# Altium schematic sheet NUCLEO-F410RB-Motor.SchDoc
size A4
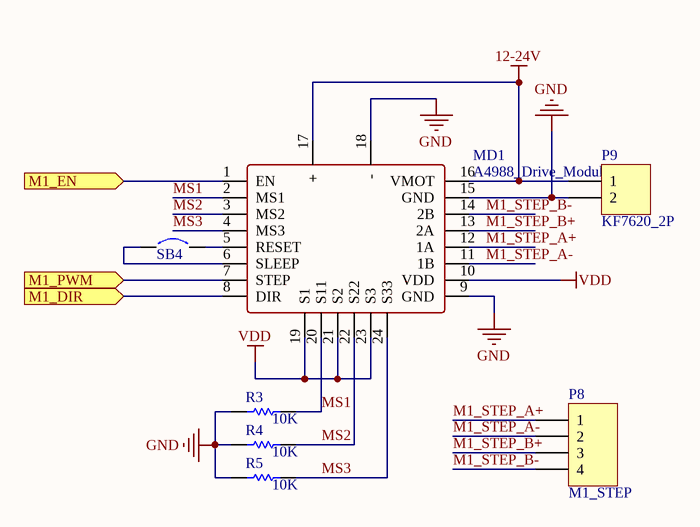
[diagram p0: NUCLEO-F410RB-Motor.SchDoc]

## Parts
MD1  A4988_Drive_Module  [A4988_Module]
P8  M1_STEP  [HDR1X4-Male]
P9  KF7620_2P  [KF-7.62-2P]
R3  value 10K  [R0603]  (hidden comment: Res_US)
R4  value 10K  [R0603]  (hidden comment: Res_US)
R5  value 10K  [R0603]  (hidden comment: Res_US)
SB4  Circuit Breaker  [JP2_SMD]  (value not drawn)

## Ports
M1_DIR (in), M1_EN (in), M1_PWM (in)

## Nets
12-24V: MD1.16(VMOT) MD1.17(+) P9.1
GND: MD1.9(GND) MD1.15(GND) MD1.18(-) P9.2 R3.1 R4.1 R5.1
VDD: MD1.10(VDD) MD1.19(S1) MD1.21(S2) MD1.23(S3)
M1_DIR: MD1.8(DIR) ; port M1_DIR
M1_EN: MD1.1(EN) ; port M1_EN
M1_PWM: MD1.7(STEP) ; port M1_PWM
M1_STEP_A+: MD1.12(1A) P8.1
M1_STEP_A-: MD1.11(1B) P8.2
M1_STEP_B+: MD1.13(2A) P8.3
M1_STEP_B-: MD1.14(2B) P8.4
MS1: MD1.2(MS1) MD1.20(S11) R3.2
MS2: MD1.3(MS2) MD1.22(S22) R4.2
MS3: MD1.4(MS3) MD1.24(S33) R5.2
NetMD1_5: MD1.5(RESET) SB4.2
NetMD1_6: MD1.6(SLEEP) SB4.1

## Library data of the parts
P8 = Header 4: Header, 4-Pin; LatestRevisionDate: 17-Jul-2002; LatestRevisionNote: Re-released for DXP Platform.; Publisher: Altium Limited
P9 = KF7620_2P: KF7620 接线端子; LatestRevisionDate: 17-Jul-2002; LatestRevisionNote: Re-released for DXP Platform.; Publisher: Altium Limited
R3-R5 = Res_US: Resistor; Published: 8-Jun-2000; LatestRevisionDate: 29-May-2009; LatestRevisionNote: IPC-7351 Footprint Added.; PackageReference: J1-0603; Publisher: Altium Limited; PackageDescription: Chip Resistor
SB4 = Circuit Breaker: Solder: NO; Published: 24-Mar-1999; Revision: July-2002: Re-released for DXP Platform.; Publisher: Altium Limited